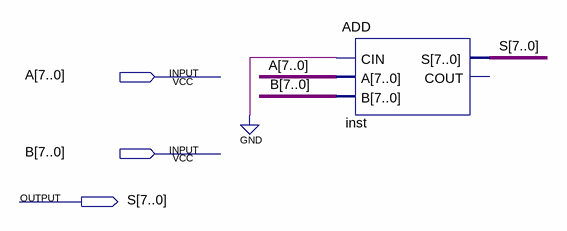
[diagram p0: schematic sheet]
// Quartus schematic ADD8bit.bdf as structural Verilog: 1 symbols, 3 pins
module ADD8bit (
  input  [7:0] A,
  input  [7:0] B,
  output [7:0] S
);

  ADD inst (.CIN(1'b0), .A(A), .B(B), .S(S));  // open: COUT
endmodule
